# EAGLE design kicker (EAGLE 5.10)
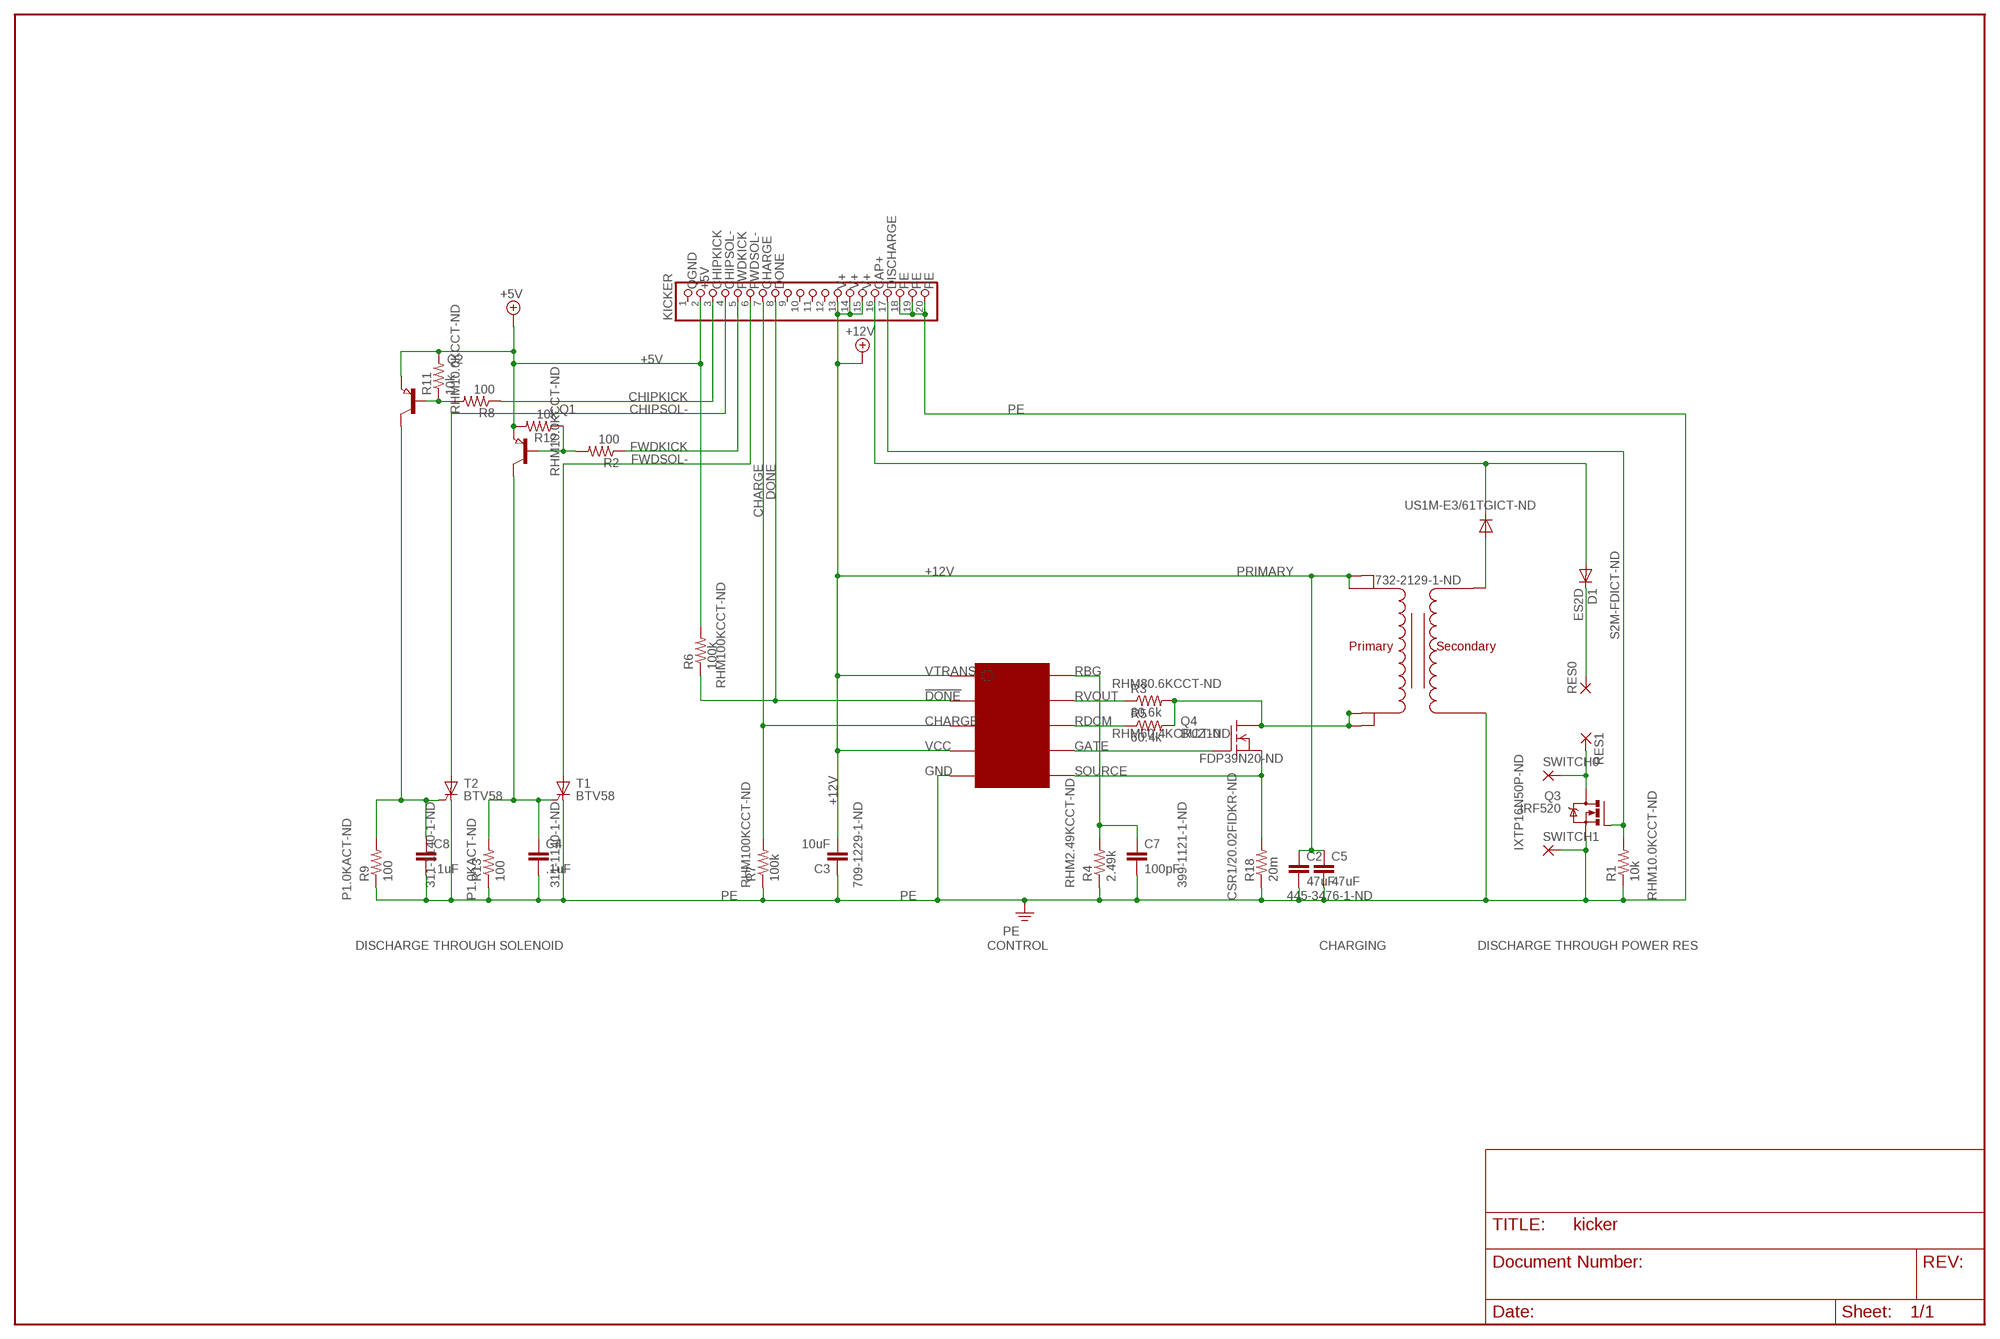
[diagram p0: schematic, sheet 1]

## Parts
C2  47uF  C-EUC1210  [C1210]
C3  10uF  C-EUC0805  [C0805]
C4  .1uF  C-EUC0805  [C0805]
C5  47uF  C-EUC1210  [C1210]
C7  100pF  C-EUC0805  [C0805]
C8  .1uF  C-EUC0805  [C0805]
D1  ES2D  [SMB]
D4  US1M  [SMA]
KICKER  PINHD-1X20  [1X20]
Q1  PNP-TRANSISTOR_SOT23W  [SOT23W]
Q2  PNP-TRANSISTOR_SOT23W  [SOT23W]
Q3  IRF520  [TO220BV]
Q4  BUZ10  [TO220]
R1  10k  R-US_R0805  [R0805]
R2  100  R-US_R0805  [R0805]
R3  80.6k  R-US_R0805  [R0805]
R4  2.49k  R-US_R0805  [R0805]
R5  60.4k  R-US_R0805  [R0805]
R6  100k  R-US_R0805  [R0805]
R7  100k  R-US_R0805  [R0805]
R8  100  R-US_R0805  [R0805]
R9  100  R-US_R0805  [R0805]
R11  10k  R-US_R0805  [R0805]
R12  10k  R-US_R0805  [R0805]
R13  100  R-US_R0805  [R0805]
R18  20m  R-US_M1206  [M1206]
RES0  3,81/1,4  [3,81/1,4]
RES1  3,81/1,4  [3,81/1,4]
SWITCH0  3,81/1,4  [3,81/1,4]
SWITCH1  3,81/1,4  [3,81/1,4]
T1  BTV58  [TO220CS]
T2  BTV58  [TO220CS]
U$1  LT3750  [10-MSOP]
U$2  32052-TRANSFORMER  [10-TRANSFORMER]

## Nets
+5V: KICKER.2 Q1.2(E) Q2.2(E) R6.2 R11.2 R12.2
CAP+: D1.A D4.P$2 KICKER.16
CHARGE: KICKER.7 R7.2 U$1.P$3
CHIPKICK: KICKER.3 R8.1
CHIPSOL-: KICKER.4 T2.A
CSP: Q4.3(S) R18.2 U$1.P$6
DISCHARGE: KICKER.17 Q3.G R1.2
DONE: KICKER.8 R6.1 U$1.P$2
FWDKICK: KICKER.5 R2.1
FWDSOL-: KICKER.6 T1.A
N$1: Q1.1(B) R2.2 R12.1
N$2: D4.P$1 U$2.P$1
N$3: R3.1 U$1.P$9
N$4: Q2.1(B) R8.2 R11.1
N$5: R5.1 U$1.P$8
N$6: C7.1 R4.2 U$1.P$10
N$7: Q4.1(G) U$1.P$7
N$9: D1.C RES0.1(P)
N$16: C4.1 Q1.3(C) R13.2 T1.G
N$19: C8.1 Q2.3(C) R9.2 T2.G
N$21: Q4.2(D) R3.2 R5.2 U$2.P$6 U$2.P$7
N$26: Q3.D RES1.1(P) SWITCH0.1(P)
PE: C2.2 C3.1 C4.2 C5.2 C7.2 C8.2 KICKER.18 KICKER.19 KICKER.20 Q3.S R1.1 R4.1 R7.1 R9.1 R13.1 R18.1 SWITCH1.1(P) T1.C T2.C U$1.P$5 U$2.P$10
V+: C2.1 C3.2 C5.1 KICKER.13 KICKER.14 KICKER.15 U$1.P$1 U$1.P$4 U$2.P$4 U$2.P$5 ; supply symbol labelled +12V
Unconnected: KICKER.1 KICKER.9 KICKER.10 KICKER.11 KICKER.12

## Notes on the sheet
- QGND | +5V | CHIPKICK | CHIPSOL- | FWDKICK | FWDSOL- | CHARGE | DONE | V+ | V+ | V+ | CAP+ | DISCHARGE | PE | PE | PE
- +5V
- CHIPKICK
- RHM10.0KCCT-ND | CHIPSOL- | PE
- FWDKICK
- FWDSOL- | CHARGE | DONE
- RHM10.0KCCT-ND
- US1M-E3/61TGICT-ND
- S2M-FDICT-ND
- +12V | PRIMARY | 732-2129-1-ND
- VTRANS | RBG
- RHM100KCCT-ND | RHM80.6KCCT-ND
- !DONE | RVOUT
- CHARGE | RDCM
- RHM60.4KCRCT-ND
- VCC | GATE
- FDP39N20-ND
- +12V | GND | SOURCE
- IXTP16N50P-ND
- 311-1140-1-ND | 311-1140-1-ND | RHM100KCCT-ND | 709-1229-1-ND | RHM2.49KCCT-ND | 399-1121-1-ND
- P1.0KACT-ND | P1.0KACT-ND | PE | PE | CSR1/20.02FIDKR-ND | 445-3476-1-ND | RHM10.0KCCT-ND
- DISCHARGE THROUGH SOLENOID | CONTROL | CHARGING | DISCHARGE THROUGH POWER RES

## Library data of the parts
C2-C5 C7 C8 = rcl:C-EU: CAPACITOR, European symbol
D1 = diode:ES2D: DIODE super fast rectifier, 2 A
D4 = kickerchips:US1M: US1M diode Digikey part #: US1M-E3/61TGICT-ND
KICKER = pinhead:PINHD-1X20: PIN HEADER
Q1 Q2 = semicon-smd-ipc:PNP-TRANSISTOR_: PNP TRANSISTOR
Q3 = transistor-power:IRF520: HEXFET Power MOSFET
Q4 = transistor-fet:BUZ10: N-Channel Enhancement MOSFET 50V; 20A; 0,080Ohm
R1-R9 R11-R13 R18 = rcl:R-US_: RESISTOR, American symbol
RES0 RES1 SWITCH0 SWITCH1 = wirepad:3,81/1,4: THROUGH-HOLE PAD
T1 T2 = triac:BTV58: THYRISTOR
U$1 = kickerchips:LT3750
U$2 = kickerchips:32052-TRANSFORMER: 32052 flyback transformer digikey #: 732-2129-1-ND

## Board
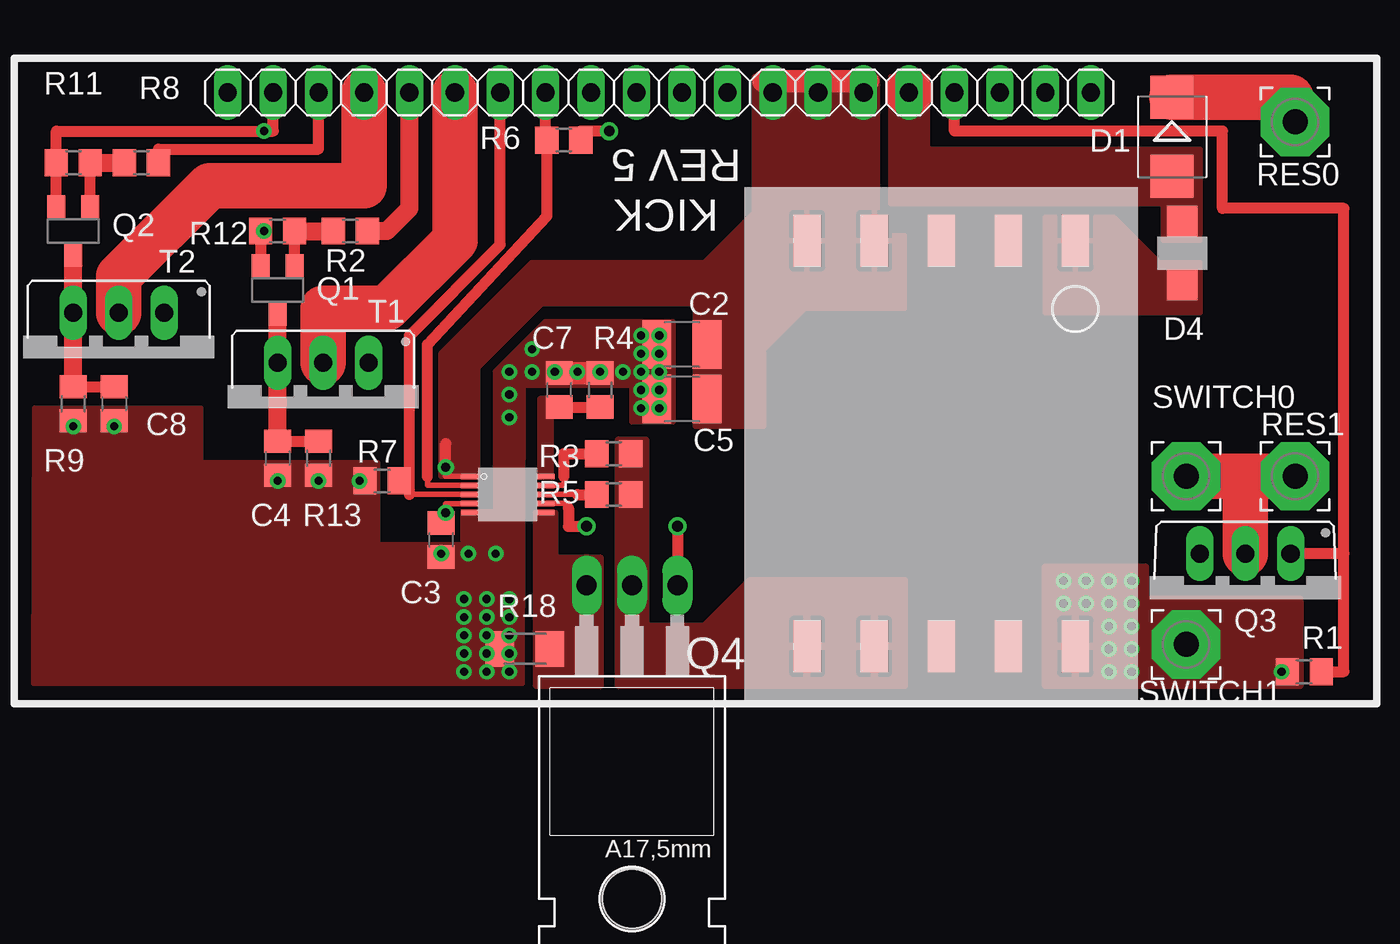
[diagram p1: board, top side]
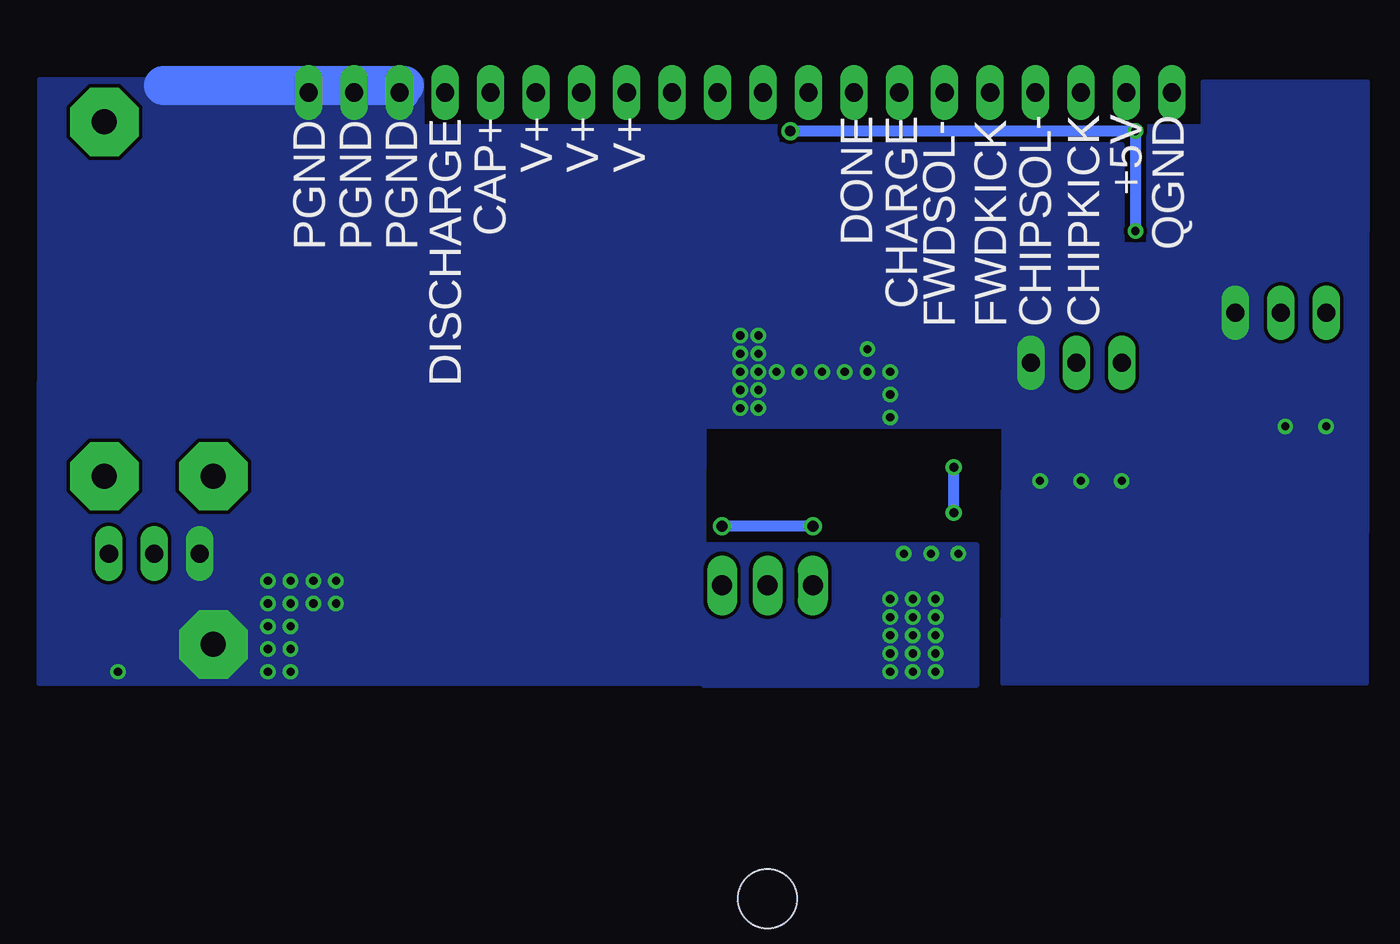
[diagram p2: board, bottom side, seen from below]

No outline drawn. Coordinates in mm, seen from the top.
Copper layers (1*16): Top 0.035mm / dielectric 1.5mm / Bottom 0.035mm
Design rules "default": minimum track width 10mil, minimum drill 24mil, track to track 8mil, track to pad 8mil, pad to pad 8mil, via to via 8mil, smd to smd 8mil, copper to edge 40mil, drill to drill 8mil, minimum pad ring 10mil, minimum via ring 8mil, stop-mask expansion 4mil, vias tented up to drill 0mil, thermal gap 10mil

### Footprints (pad centres in the part's own frame; a part is rotated, then mirrored left to right if it is on the bottom)
C1210 = smd 1.6 x 2.7: 1 -1.4,0; 2 1.4,0
C0805 = smd 1.3 x 1.5: 1 -0.95,0; 2 0.95,0
SMB = smd 2.4 x 2.4: A 2.2,0; C -2.2,0
SMA = smd 1.7 x 1.7: P$1 -1.79,0; P$2 1.79,0
1X20 = drill 1.016 long: 1 -24.13,0; 2 -21.59,0; 3 -19.05,0; 4 -16.51,0; 5 -13.97,0; 6 -11.43,0; 7 -8.89,0; 8 -6.35,0; 9 -3.81,0; 10 -1.27,0; 11 1.27,0; 12 3.81,0; 13 6.35,0; 14 8.89,0; 15 11.43,0; 16 13.97,0; 17 16.51,0; 18 19.05,0; 19 21.59,0; 20 24.13,0
SOT23W = smd 1 x 1.4: 1 -0.95,-1.303; 2 0.95,-1.303; 3 0,1.303
TO220BV = drill 1.016 long: D 0,-2.54; G -2.54,-2.54; S 2.54,-2.54
TO220 = drill 1.118 long: 1 -2.54,-6.35; 2 0,-6.35; 3 2.54,-6.35 | hole 3.302: 0,11.176
R0805 = smd 1.3 x 1.5: 1 -0.95,0; 2 0.95,0
M1206 = smd 1.6 x 2: 1 -1.4,0; 2 1.4,0
3,81/1,4 = drill 1.397 pad 3.81 octagon: 1 0,0
TO220CS = drill 1.016 long: A 0,-2.54; C -2.54,-2.54; G 2.54,-2.54
10-MSOP = smd 0.97 x 0.31: P$1 -0.485,-0.155; P$2 -0.485,-0.655; P$3 -0.485,-1.155; P$4 -0.485,-1.655; P$5 -0.485,-2.155; P$6 3.785,-2.155; P$7 3.785,-1.655; P$8 3.785,-1.155; P$9 3.785,-0.655; P$10 3.785,-0.155
10-TRANSFORMER = smd 2.92 x 1.52: P$1 0,0; P$2 0,-3.75; P$3 0,-7.5; P$4 0,-11.25; P$5 0,-15; P$6 22.67,-15; P$7 22.67,-11.25; P$8 22.67,-7.5; P$9 22.67,-3.75; P$10 22.67,0

### Placement (x,y rotation side)
C2  37.34,20.07 180 top
C3  23.88,9.14 90 top
C4  14.73,13.72 270 top
C5  37.34,17.02 180 top
C7  30.48,17.53 90 top
C8  5.59,16.76 270 top
D1  64.74,31.68 270 top
D4  65.31,25.18 90 top
KICKER  36.07,34.16 0 top
Q1  14.73,23.11 180 top
Q2  3.3,26.42 180 top
Q3  68.83,5.84 180 top
Q4  34.54,0.25 180 top
R1  72.14,1.78 0 top
R2  200  [R0805]  18.8,26.42 180 top
R3  33.53,13.97 0 top
R4  32.77,17.53 270 top
R5  33.53,11.68 0 top
R6  30.73,31.5 0 top
R7  20.57,12.45 0 top
R8  200  [R0805]  7.11,30.23 180 top
R9  1k  [R0805]  3.3,16.76 90 top
R11  3.3,30.23 180 top
R12  14.73,26.42 180 top
R13  1k  [R0805]  17.02,13.72 90 top
R18  28.55,3.05 0 top
RES0  71.63,32.51 0 top
RES1  71.63,12.7 0 top
SWITCH0  65.53,12.7 0 top
SWITCH1  65.53,3.3 0 top
T1  17.27,16.51 180 top
T2  5.84,19.3 180 top
U$1  25.95,12.85 0 top
U$2  59.34,25.87 270 top

### Tracks (layer width: path | path; a pad name or v marks a point on that pad's centre or on a via)
+5V  (via drill 0.46, 0.6)
  Top 0.61: R11.2 Q2.2 2.35,32 v13.97,32 14.48,32 KICKER.2 | Q1.2 R12.2 v13.97,26.42 | R6.2 31.68,32 v33.27,32
  Bottom 0.61: v13.97,26.42 v13.97,32 32.77,32 v33.27,32
CAP+
  Top 2.54: 50.04,34.29 50.04,34.04
  pour Top (no thermals): 66.29,25.91 66.29,30.99 51.05,30.99 51.05,35.05 49.02,35.05 49.02,27.94 64.26,27.94 64.26,25.91
CHARGE
  Top 0.305: 22.1,11.69 U$1.P$3 | 22.1,11.69 22.1,11.68 | 22.1,11.69 21.52,12.27 R7.2
  Top 0.61: KICKER.7 27.18,25.65 22.1,20.57 22.1,11.69
CHIPKICK
  Top 0.61: KICKER.3 17.02,30.99 8.06,30.99 R8.1
CHIPSOL-
  Top 2.54: T2.A 5.84,23.88 10.92,28.96 19.56,28.96 KICKER.4
CSP
  pour Top (no thermals): 29.21,10.67 30.23,10.67 30.23,8.13 32.77,8.13 32.77,1.02 29.21,1.02
DISCHARGE
  Top 0.61: 74.36,8.38 Q3.G | 74.36,8.38 74.36,27.69 67.56,27.69 67.56,32 52.58,32 KICKER.17 | 74.36,8.38 74.36,1.78 R1.2
DONE
  Top 0.305: U$1.P$2 23.11,12.19 23.11,12.7 | R6.1 29.72,31.56
  Top 0.61: 29.72,31.56 KICKER.8 | R6.1 29.78,27.24 23.11,20.07 23.11,12.7
FWDKICK
  Top 1.016: KICKER.5 22.1,27.69 20.83,26.42 R2.1
FWDSOL-
  Top 2.54: T1.A 17.27,22.1 20.83,22.1 24.64,25.91 KICKER.6
N$1
  Top 0.61: Q1.1 R12.1
  Top 1.016: R12.1 R2.2
N$2
  pour Top: 57.66,27.18 61.47,27.18 61.47,21.84 57.66,21.84
  pour Top (no thermals): 61.47,27.18 64.01,24.64 66.29,24.64 66.29,21.84 61.47,21.84
N$3
  Top 0.305: U$1.P$9 30.73,12.19 30.73,12.7
  Top 0.61: 30.73,12.7 30.73,13.97 R3.1
N$4
  Top 0.61: Q2.1 R11.1
  Top 1.016: R11.1 R8.2
N$5
  Top 0.305: U$1.P$8 31.5,11.69 31.5,11.68
  Top 0.61: 31.5,11.68 R5.1
N$6
  Top 0.61: C7.1 R4.2
  Top 1.016: R4.2 32.77,16.51
  pour Top (no thermals): 29.46,12.7 29.97,12.7 29.97,17.02 29.46,17.02
N$7  (via drill 0.6)
  Top 0.305: U$1.P$7 30.99,11.19 30.99,10.92
  Top 0.61: 30.99,10.92 30.99,9.91 v32,9.91 | v37.08,9.91 Q4.1
  Bottom 0.61: v32,9.91 v37.08,9.91
N$9
  Top 2.54: D1.C 71.37,33.88 RES0.1
N$16
  Top 0.61: C4.1 R13.2 | 14.7,19.05 T1.G 14.73,18.8
  Top 1.016: T1.G Q1.3 | C4.1 14.73,18.8
N$19
  Top 0.61: R9.2 C8.1
  Top 1.016: R9.2 T2.G Q2.3
N$21
  pour Top (no thermals): 33.78,1.02 41.15,1.02 41.15,6.86 38.61,4.32 35.31,4.32 35.31,14.73 33.78,14.73
  pour Top: 41.15,6.86 49.78,6.86 49.78,1.02 41.15,1.02
N$26
  Top 2.54: SWITCH0.1 68.83,12.7 | 68.83,12.7 RES1.1 | 68.83,12.7 Q3.D
PE  (via drill 0.46)
  Top 1.27: C7.2 R4.1
  Top 2.54: SWITCH1.1 65.53,3.2
  Bottom 2.184: 55.12,34.54 68.33,34.54 | 55.12,34.54 54.86,34.54 | KICKER.18 55.12,34.54
  other vias: 58.67,5.59 59.94,5.59 61.21,5.59 61.21,4.32 61.21,3.05 61.21,1.78 70.87,1.78 62.48,1.78 62.48,3.05 62.48,4.32 62.48,5.59 27.69,1.78 27.69,2.79 27.69,3.81 26.42,1.78 26.42,2.79 26.42,3.81 28.96,18.54 27.69,18.54 28.96,19.81 30.23,18.54 31.5,18.54 32.77,18.54 34.04,18.54 35.05,20.57 35.05,19.56 35.05,18.54 35.05,17.53 35.05,16.51 36.07,16.51 36.07,17.53 36.07,18.54 36.07,19.56 36.07,20.57 3.3,15.49 5.59,15.49 14.73,12.45 17.02,12.45 26.42,4.83 27.69,4.83 25.15,4.83 25.15,3.81 25.15,2.79 58.67,6.86 59.94,6.86 61.21,6.86 62.48,6.86 25.15,1.78 27.69,17.27 27.69,16 25.15,5.84 26.42,5.84 27.69,5.84 19.3,12.45 23.88,8.38 25.4,8.38 26.92,8.38
  pour Top (no thermals): 28.4,1.14 28.45,17.78 34.54,17.78 34.54,15.75 36.83,15.75 36.83,21.34 29.72,21.34 26.92,18.54 26.92,8.89 20.32,8.89 20.32,13.46 10.41,13.46 10.41,16.51 1.14,16.51 1.09,1.14
  pour Top: 57.66,1.02 57.66,7.62 63.25,7.62 63.25,1.02
  pour Top (no thermals): 25.15,10.67 26.92,10.67 26.92,9.14 25.15,9.14
  pour Bottom (no thermals): 22.86,1.02 22.86,8.89 38.1,8.89 38.1,1.02
  pour Top (no thermals): 63.25,5.84 71.88,5.84 71.88,1.02 63.25,1.02
  pour Bottom (no thermals): 1.02,34.72 10.16,34.72 10.16,32.26 13.21,32.26 13.21,25.65 14.73,25.65 14.73,31.24 34.04,31.24 34.04,32.26 53.85,32.26 53.9,34.87 75.23,34.87 75.26,1.14 38.18,1.14 38.1,15.49 21.34,15.49 21.39,1.17 1.07,1.17
V+  (via drill 0.51)
  Top 0.305: U$1.P$1 24.13,12.7 v24.13,13.21 | U$1.P$4 25.46,11.18 24.13,11.18 v24.13,10.67
  Top 0.61: v24.13,13.21 24.13,14.54 | v24.13,10.67 24.13,10.35 C3.2
  Top 1.27: 41.91,34.8 47.5,34.8 | 47.5,34.8 47.75,34.8 | 47.5,34.8 KICKER.15
  Bottom 0.61: v24.13,10.67 v24.13,13.21
  pour Top: 41.91,28.7 48.26,28.7 48.26,22.1 44.2,22.1 41.91,19.81
  pour Top (no thermals): 48.26,35.05 48.26,28.7 41.91,28.7 41.91,15.49 38.1,15.49 38.1,22.35 29.46,22.35 25.91,18.8 25.91,12.7 23.88,12.7 23.88,19.56 28.96,24.64 38.61,24.64 41.4,27.43 41.4,35.05
  pour Top: 48.01,22.1 49.78,22.1 49.78,26.16 48.01,26.16

### Text on the board
tNames: REV 5 | KICK | D4
bNames: V+ | V+ | V+ | +5V | DONE | CAP+ | QGND | PGND | PGND | PGND | CHARGE | CHIPKICK | CHIPSOL- | FWDKICK | FWDSOL- | DISCHARGE